# Altium schematic sheet MCP_IO_expander.SchDoc: IO expander
size A4; Project: STM32MP15x-EVAL; Date: Not used; ApprovedBy: Not used; CheckedBy: Not used; Author: Not used; CompanyName: STMicroelectronics; DrawnBy: Not used; Engineer: Not used; Organization: Not used; Address1: Not used; Address2: Not used; Address3: Not used; Address4: Not used; DocumentNumber: 16; Revision: Not used; SheetNumber: 16; SheetTotal: 17; CurrentTime: Not used; CurrentDate: Not used; Time: Not used; DocumentFullPathAndName: Not used; DocumentName: Not used; ModifiedDate: Not used; ImagePath: Not used; ProjectName: Not used; Application_BuildNumber: Not used
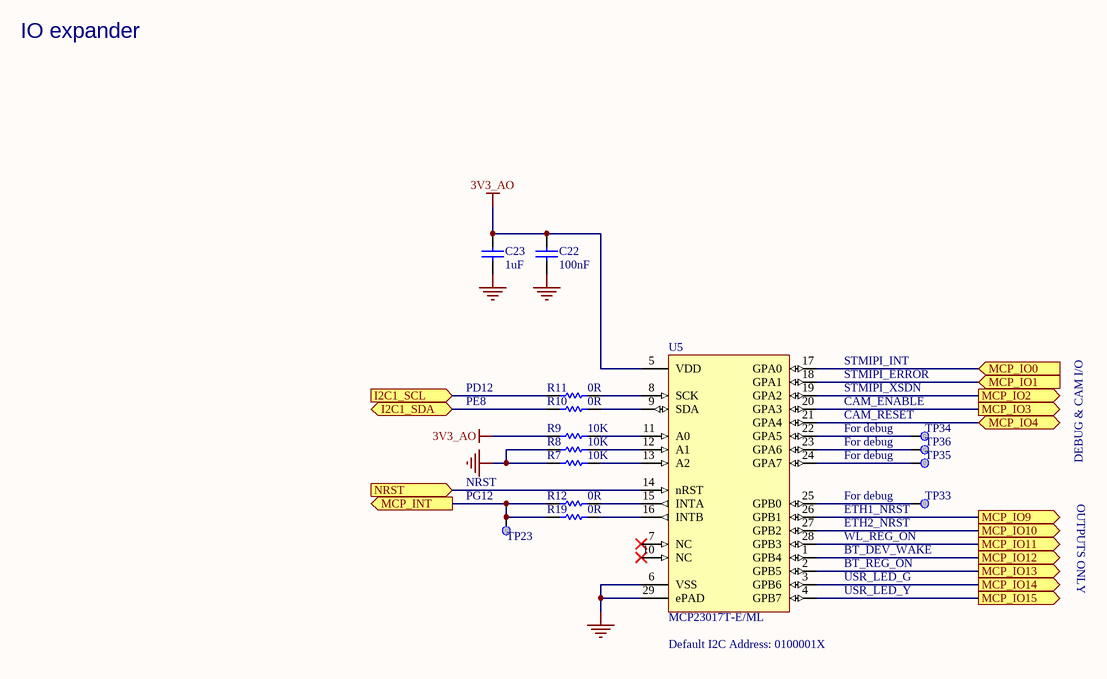
[diagram p0: MCP_IO_expander.SchDoc]

## Parts
C22  value 100nF  [C0402]  (hidden comment: Capacitor)
C23  value 1uF  [C0201_MURATA_GRM033_H0P3]  (hidden comment: Capacitor)
R7  value 10K  [R0402]  (hidden comment: Resistor)
R8  value 10K  [R0402]  (hidden comment: Resistor)
R9  value 10K  [R0402]  (hidden comment: Resistor)
R10  value 0R  [R0402]  (hidden comment: Resistor)
R11  value 0R  [R0402]  (hidden comment: Resistor)
R12  value 0R  [R0402]  (hidden comment: Resistor)
R19  value 0R  [R0402]  (hidden comment: Resistor)
TP23  Test Point  [TP_SMD_1MM]  (value not drawn)  (no BOM)
TP33  Test Point  [TP_SMD_1MM]  (value not drawn)  (no BOM)
TP34  Test Point  [TP_SMD_1MM]  (value not drawn)  (no BOM)
TP35  Test Point  [TP_SMD_1MM]  (value not drawn)  (no BOM)
TP36  Test Point  [TP_SMD_1MM]  (value not drawn)  (no BOM)
U5  value MCP23017T-E/ML  [ICC_QFN28-EPAD_6X6_P065]  (hidden comment: MCP23017)

## Ports
I2C1_SCL (in), I2C1_SDA (bidir), MCP_INT (out), MCP_IO0 (in), MCP_IO1 (in), MCP_IO2 (out), MCP_IO3 (out), MCP_IO4 (bidir), MCP_IO9 (out), MCP_IO10 (out), MCP_IO11 (out), MCP_IO12 (out), MCP_IO13 (out), MCP_IO14 (out), MCP_IO15 (out), NRST (in)

## Nets
3V3_AO: C22.2 C23.2 R9.1 U5.5(VDD)
GND: C22.1 C23.1 R7.1 R8.1 U5.6(VSS) U5.29(ePAD)
I2C1_SCL: R11.1 ; port I2C1_SCL
I2C1_SDA: R10.1 ; port I2C1_SDA
MCP_INT: R12.1 R19.1 TP23.1 ; port MCP_INT
MCP_IO0: U5.17(GPA0) ; port MCP_IO0
MCP_IO1: U5.18(GPA1) ; port MCP_IO1
MCP_IO2: U5.19(GPA2) ; port MCP_IO2
MCP_IO3: U5.20(GPA3) ; port MCP_IO3
MCP_IO4: U5.21(GPA4) ; port MCP_IO4
MCP_IO9: U5.26(GPB1) ; port MCP_IO9
MCP_IO10: U5.27(GPB2) ; port MCP_IO10
MCP_IO11: U5.28(GPB3) ; port MCP_IO11
MCP_IO12: U5.1(GPB4) ; port MCP_IO12
MCP_IO13: U5.2(GPB5) ; port MCP_IO13
MCP_IO14: U5.3(GPB6) ; port MCP_IO14
MCP_IO15: U5.4(GPB7) ; port MCP_IO15
NRST: U5.14(nRST) ; port NRST
NetR7_2: R7.2 U5.13(A2)
NetR8_2: R8.2 U5.12(A1)
NetR9_2: R9.2 U5.11(A0)
NetR10_2: R10.2 U5.9(SDA)
NetR11_2: R11.2 U5.8(SCK)
NetR12_2: R12.2 U5.15(INTA)
NetR19_2: R19.2 U5.16(INTB)
NetTP33_1: TP33.1 U5.25(GPB0)
NetTP34_1: TP34.1 U5.22(GPA5)
NetTP35_1: TP35.1 U5.24(GPA7)
NetTP36_1: TP36.1 U5.23(GPA6)

Not connected (* = marked no-connect by the designer): U5 7(NC)* 10(NC)*

## Notes on the sheet
- IO expander
- STMIPI_INT
- STMIPI_ERROR
- PD12
- PE8
- CAM_RESET
- For debug
- CAM_ENABLE
- STMIPI_XSDN
- (near TP23) PG12
- (near TP23) NRST
- (near TP33) ETH1_NRST
- OUTPUTS ONLY
- DEBUG & CAM I/O
- BT_DEV_WAKE
- BT_REG_ON
- (near TP33) ETH2_NRST
- WL_REG_ON
- USR_LED_G
- (near U5) Default I2C Address: 0100001X
- USR_LED_Y
- Title:
- Project:
- Size:
- Revision:
- Variant:
- A4
- -
- Date:
- Reference:
- Sheet:
- of

## Library data of the parts
C22 = MCD-00006: Capacitor, MLCC, 100nF, 16V, X7R, +/-10%, 0402, T=0.5mm; Part_Preference: Recommended; Manufacturer: YAGEO; Manufacturer_Part_Number: CC0402KRX7R7BB104; Order_Code_RS: 616-9701; Component_Country_Of_Origin: China; ShowFields: YES; ID: 2474; Internal_Part_Number: MCD-00006; Status: Released; Part_Type: Capacitor; Package: 0402; ComponentLink1URL: http://tunmcdsvn.tun.st.com/Component_Documentation_Library/Trunk/Capacitor/YAGEO_X7R_Series; Order_Code_Digikey: 311-1338-1-ND; Order_Code_Farnell: 9402047
C23 = MCD-02377: Capacitor, MLCC, 1uF, 6.3V, X5R, +/-20%, 0201, T=0,3mm; Part_Preference: Recommended; Manufacturer: MURATA; Manufacturer_Part_Number: GRM033R60J105MEA2; Order_Code_RS: 820-0643; Component_Country_Of_Origin: Japan; ShowFields: YES; ID: 4483; Internal_Part_Number: MCD-02377; Status: Checked; Part_Type: Capacitor; Package: 0201; ComponentLink1URL: http://tunmcdsvn.tun.st.com/Component_Documentation_Library/Trunk/Capacitor/MURATA_GRM_Series/GRM033R60J105MEA2/; Order_Code_Digikey: 490-7229-2-ND; Order_Code_Farnell: 2470448
R7-R9 = MCD-00053: Resistor, 10K, 0402, +/-1%, 1/16W; BMS_Part_Number: 9131590; Part_Preference: Recommended; Manufacturer: YAGEO; Manufacturer_Part_Number: RC0402FR-0710KL; Component_Country_Of_Origin: China; ShowFields: YES; ID: 2539; Internal_Part_Number: MCD-00053; Status: Released; Part_Type: Resistor; Package: 0402; ComponentLink1URL: http://tunmcdsvn.tun.st.com/Component_Documentation_Library/Trunk/Resistor/YAGEO_RC_L_Series; Order_Code_Digikey: 311-10.0KLRCT-ND; Order_Code_Farnell: 9239359; Order_Code_RS: N/A
R10-R12 R19 = MCD-00052: Resistor, 0R, 0402, +/-5%, 1/16W; Part_Preference: Recommended; Manufacturer: YAGEO; Manufacturer_Part_Number: RC0402JR-070RL; Order_Code_RS: 618-5804; Component_Country_Of_Origin: China; ShowFields: YES; ID: 2540; Internal_Part_Number: MCD-00052; Status: Released; Part_Type: Resistor; Package: 0402; ComponentLink1URL: http://tunmcdsvn.tun.st.com/Component_Documentation_Library/Trunk/Resistor/YAGEO_RC_L_Series; Order_Code_Digikey: 311-0.0JRCT-ND; Order_Code_Farnell: 9232516RL
TP23 TP33-TP36 = MCD-00074: Test Point 1mm; Part_Type: Misc; Part_Preference: Recommended; ShowFields: YES; ID: 2518; Internal_Part_Number: MCD-00074; Status: Released; ComponentLink1URL: http://na; Manufacturer: N/A; Manufacturer_Part_Number: N/A; Order_Code_Digikey: N/A; Order_Code_Farnell: N/A; Order_Code_RS: N/A
U5 = MCD-02210: 16-bit port expander with I2C control; Part_Preference: Recommended; Part_Type: IC; Manufacturer: MICROCHIP; Order_code_RS: 177-2846; Component_Country_Of_Origin: Unknown; ShowFields: YES; ID: 4310; Order_code_Digikey: MCP23017T-E/MLTR-ND; Order_code_Farnell: 2857786; Status: Released; ComponentLink1URL: http://tunmcdsvn.tun.st.com/Component_Datasheet_Library/Trunk/IC/MICROCHIP_IOexpander_MCP23017; Internal_Part_Number: MCD-02210; Manufacturer_Part_Number: MCP23017T-E/ML; Package: QFN28 6x6mm